# Altium schematic sheet Debug.SchDoc: USB to UART and JTAG
size B; Revision: B01; SheetNumber: 4; SheetTotal: 5; ProjectCodeName: HiFive1; ProjectName: Cinque
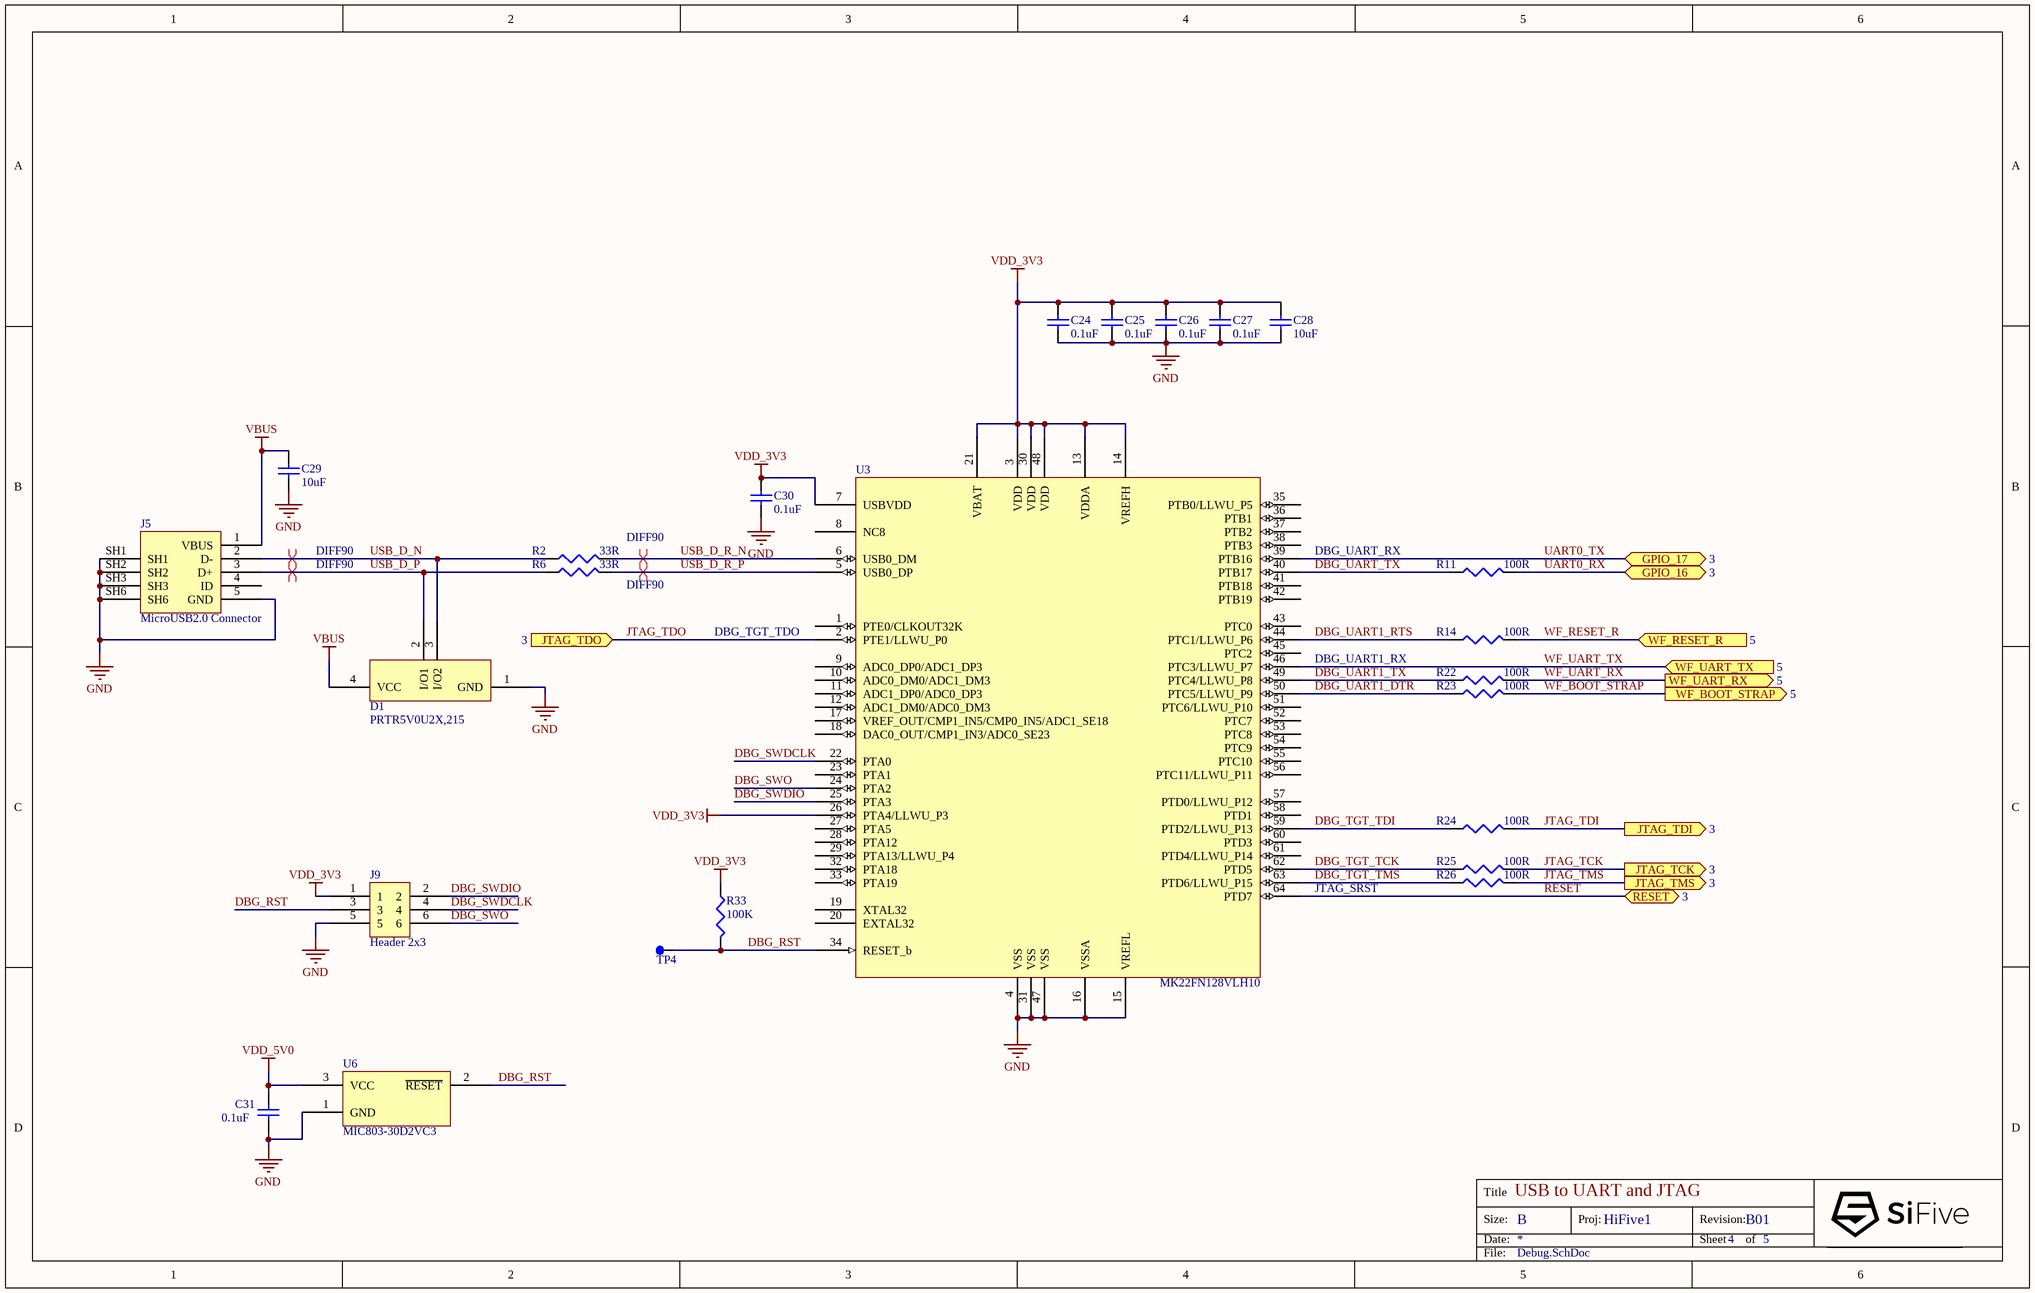
[diagram p0: Debug.SchDoc]

## Parts
C24  0.1uF  [C0402]
C25  0.1uF  [C0402]
C26  0.1uF  [C0402]
C27  0.1uF  [C0402]
C28  10uF  [C0603]
C29  10uF  [C0603]
C30  0.1uF  [C0402]
C31  0.1uF  [C0402]
D1  PRTR5V0U2X,215  [SOT-143B]
J5  MicroUSB2.0 Connector  [FCI_10118194-0001LF]
J9  Header 2x3  [TC2030-IDC-FP]  (no BOM)
R2  33R  [R0402]
R6  33R  [R0402]
R11  100R  [R0402]
R14  100R  [R0402]
R22  100R  [R0402]
R23  100R  [R0402]
R24  100R  [R0402]
R25  100R  [R0402]
R26  100R  [R0402]
R33  100K  [R0402]
TP4  Testpoint  [Testpoint_SMT]  (value not drawn)  (no BOM)
U3  MK22FN128VLH10  [LQFP-64]
U6  MIC803-30D2VC3  [SOT65P210X110-3N_A]

## Ports
GPIO_16 (bidir, see 3), GPIO_17 (bidir, see 3), JTAG_TCK (out, see 3), JTAG_TDI (out, see 3), JTAG_TDO (in, see 3), JTAG_TMS (out, see 3), RESET (bidir, see 3), WF_BOOT_STRAP (out, see 5), WF_RESET_R (in, see 5), WF_UART_RX (out, see 5), WF_UART_TX (in, see 5)

## Nets
GND: C24.2 C25.2 C26.2 C27.2 C28.1 C29.1 C30.2 C31.2 D1.1(GND) J5.5(GND) J5.SH1 J5.SH2 J5.SH3 J5.SH6 J9.5 U3.4(VSS) U3.15(VREFL) U3.16(VSSA) U3.31(VSS) U3.47(VSS) U6.1(GND)
VBUS: C29.2 D1.4(VCC) J5.1(VBUS)
VDD_3V3: C24.1 C25.1 C26.1 C27.1 C28.2 C30.1 J9.1 R33.1 U3.3(VDD) U3.7(USBVDD) U3.13(VDDA) U3.14(VREFH) U3.21(VBAT) U3.26(PTA4/LLWU_P3) U3.30(VDD) U3.48(VDD)
VDD_5V0: C31.1 U6.3(VCC)
DBG_RST: J9.3 R33.2 TP4.1 U3.34(RESET_b) U6.2(~{RESET})
DBG_SWDCLK: J9.4 U3.22(PTA0)
DBG_SWDIO: J9.2 U3.25(PTA3)
DBG_SWO: J9.6 U3.24(PTA2)
DBG_TGT_TCK: R25.1 U3.62(PTD5)
DBG_TGT_TDI: R24.1 U3.59(PTD2/LLWU_P13)
DBG_TGT_TMS: R26.1 U3.63(PTD6/LLWU_P15)
DBG_UART1_DTR: R23.1 U3.50(PTC5/LLWU_P9)
DBG_UART1_RTS: R14.1 U3.44(PTC1/LLWU_P6)
DBG_UART1_TX: R22.1 U3.49(PTC4/LLWU_P8)
DBG_UART_TX: R11.1 U3.40(PTB17)
JTAG_TCK: R25.2 ; port JTAG_TCK
JTAG_TDI: R24.2 ; port JTAG_TDI
JTAG_TDO: U3.2(PTE1/LLWU_P0) ; port JTAG_TDO
JTAG_TMS: R26.2 ; port JTAG_TMS
RESET: U3.64(PTD7) ; port RESET
UART0_RX: R11.2 ; port GPIO_16
UART0_TX: U3.39(PTB16) ; port GPIO_17
USB_D_N: D1.3(I/O2) J5.2(D-) R2.1
USB_D_P: D1.2(I/O1) J5.3(D+) R6.1
USB_D_R_N: R2.2 U3.6(USB0_DM)
USB_D_R_P: R6.2 U3.5(USB0_DP)
WF_BOOT_STRAP: R23.2 ; port WF_BOOT_STRAP
WF_RESET_R: R14.2 ; port WF_RESET_R
WF_UART_RX: R22.2 ; port WF_UART_RX
WF_UART_TX: U3.46(PTC3/LLWU_P7) ; port WF_UART_TX

Not connected (* = marked no-connect by the designer): J5 4(ID); U3 1(PTE0/CLKOUT32K) 8(NC8) 9(ADC0_DP0/ADC1_DP3) 10(ADC0_DM0/ADC1_DM3) 11(ADC1_DP0/ADC0_DP3) 12(ADC1_DM0/ADC0_DM3) 17(VREF_OUT/CMP1_IN5/CMP0_IN5/ADC1_SE18) 18(DAC0_OUT/CMP1_IN3/ADC0_SE23) 19(XTAL32) 20(EXTAL32) 23(PTA1) 27(PTA5) 28(PTA12) 29(PTA13/LLWU_P4) 32(PTA18) 33(PTA19) 35(PTB0/LLWU_P5) 36(PTB1) 37(PTB2) 38(PTB3) 41(PTB18) 42(PTB19) 43(PTC0) 45(PTC2) 51(PTC6/LLWU_P10) 52(PTC7) 53(PTC8) 54(PTC9) 55(PTC10) 56(PTC11/LLWU_P11) 57(PTD0/LLWU_P12) 58(PTD1) 60(PTD3) 61(PTD4/LLWU_P14)

## Layout directives
differential pair; net class DIFF90: USB_D_N, USB_D_P, USB_D_R_N, USB_D_R_P

## Notes on the sheet
- DBG_UART_RX
- DBG_TGT_TDO
- DBG_UART1_RX
- JTAG_SRST
- Title
- Size:
- Date:
- B
- Proj:
- Revision:
- Sheet
- of
- File:

## Library data of the parts
C24-C27 C30 C31 = C0100004: 0.10µF 16V Ceramic Capacitor X7R 0402; Manufacturer: Samsung Electro-Mechanics; Manufacturer PN: CL05B104KO5NFNC; Tolerance: ±10%; Part Number: C0100004; Value: 0.1uF; Type: X7R; Voltage Rating: 16V; Operating Temperature: -55°C ~ 125°C
C28 C29 = C0100033: CAP CER 10UF 10V X5R 0603; Manufacturer: Murata Electronics; Manufacturer PN: GRM188R61A106KE69J; Tolerance: ±10%; Part Number: C0100033; Value: 10uF; Type: X5R; Voltage Rating: 10V; Operating Temperature: -55°C ~ 85°C
D1 = D0000012: TVS DIODE 5.5V SOT143B; Manufacturer: Nexperia; Voltage Breakdown: 6V; Part Number: D0000012; Value: PRTR5V0U2X,215; Manufacturer PN: PRTR5V0U2X,215; Temperature Range: -40°C ~ 85°C; Voltage Reverse Standoff: 5.5V
J5 = J0000048: USB - micro B USB 2.0 Receptacle Connector 5 Position Surface Mount, Right Angle, Horizontal; Manufacturer: Amphenol FCI; Manufacturer PN: 10118194-0001LF; Part Number: J0000048
J9 = J0000045: 2x3 Connector, Small footprint, no legs, no component; Manufacturer: Tag Connect; Part Number: J0000045; Manufacturer PN: TC2030-IDC-FP
R2 R6 = R0000044: RES SMD 33 OHM 1% 1/16W 0402; Manufacturer: Yageo; Manufacturer PN: RC0402FR-0733RL; Power Rating: 0.063W; Part Number: R0000044; Value: 33R; Tolerance: ±1%; Type: Thick Film; Temperature Range: -55°C ~ 155°C
R11 R14 R22-R26 = R0000020: RES SMD 100 OHM 1% 1/16W 0402; Manufacturer: Yageo; Manufacturer PN: RC0402FR-07100RL; Power Rating: 0.063W; Part Number: R0000020; Value: 100R; Tolerance: ±1%; Type: Thick Film; Temperature Range: -55°C ~ 155°C
R33 = R0000012: RES SMD 100K OHM 1% 1/16W 0402; Manufacturer: Yageo; Manufacturer PN: RC0402FR-07100KL; Power Rating: 0.063W; Part Number: R0000012; Value: 100K; Tolerance: ±1%; Type: Thick Film; Temperature Range: -55°C ~ 155°C
TP4 = M0000002: Test Point SMT; Part Number: M0000002
U3 = U0000058: ARM® Cortex®-M4 Kinetis K20 Microcontroller IC 32-Bit 100MHz 128KB (128K x 8) FLASH 64-LQFP (10x10); Manufacturer: NXP USA Inc; Part Number: U0000058; Value: MK22FN128VLH10; Manufacturer PN: MK22FN128VLH10; Temperature Range: -40°C ~ 105°C
U6 = U0000076: IC MPU SUPERVISOR SC70-3; Manufacturer: Microchip; Part Number: U0000076; Value: MIC803-30D2VC3; Manufacturer PN: MIC803-30D2VC3; Temperature Range: -40°C ~ 125°C